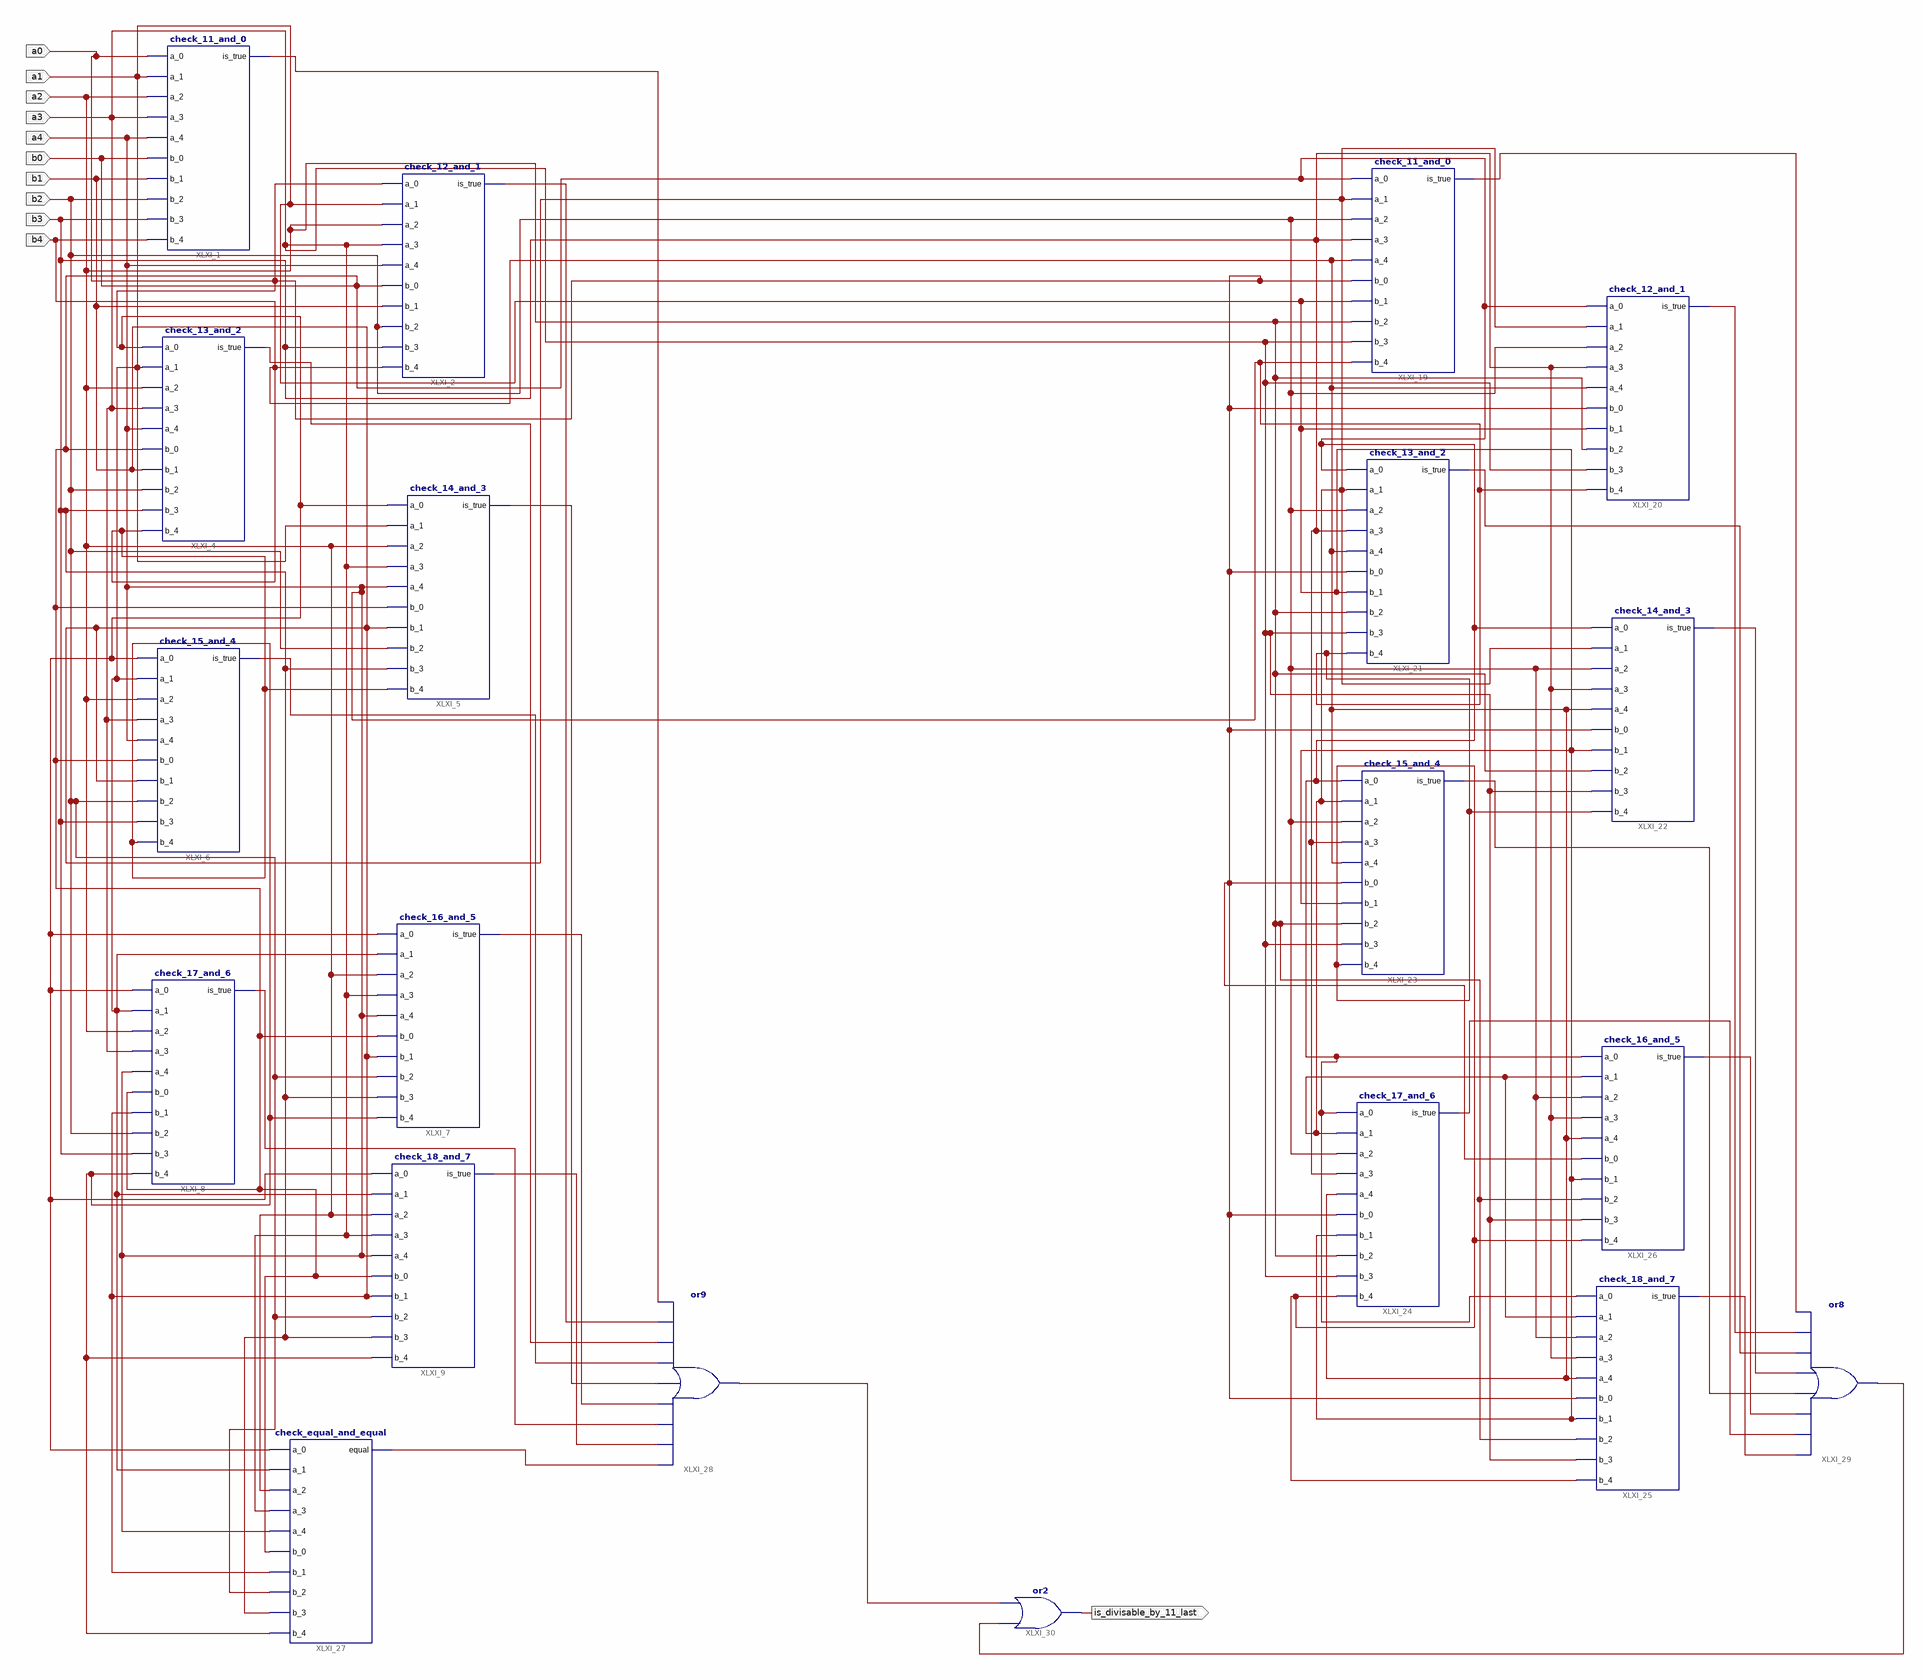
[diagram p0: schematic sheet 1]
// Xilinx ISE schematic divide_by_11_remainder.sch (spartan3adsp) as structural Verilog: 20 symbols, 11 ports
module divide_by_11_remainder (
  input  a1,
  input  a2,
  input  a3,
  input  a4,
  input  b1,
  input  b2,
  input  b3,
  input  b4,
  input  a0,
  input  b0,
  output is_divisable_by_11_last
);

  wire XLXN_142, XLXN_143, XLXN_144, XLXN_145, XLXN_146, XLXN_147, XLXN_148, XLXN_149, XLXN_150, XLXN_151,
       XLXN_152, XLXN_153, XLXN_154, XLXN_155, XLXN_156, XLXN_157, XLXN_158, XLXN_159, XLXN_160;

  check_11_and_0 XLXI_1 (
    .a_0(a0), .a_1(a1), .a_2(a2), .a_3(a3), .a_4(a4), .b_0(b0), .b_1(b1), .b_2(b2), .b_3(b3), .b_4(b4),
    .is_true(XLXN_152));
  check_12_and_1 XLXI_2 (
    .a_0(a0), .a_1(a1), .a_2(a2), .a_3(a3), .a_4(a4), .b_0(b0), .b_1(b1), .b_2(b2), .b_3(b3), .b_4(b4),
    .is_true(XLXN_151));
  check_13_and_2 XLXI_4 (
    .a_0(a0), .a_1(a1), .a_2(a2), .a_3(a3), .a_4(a4), .b_0(b0), .b_1(b1), .b_2(b2), .b_3(b3), .b_4(b4),
    .is_true(XLXN_150));
  check_14_and_3 XLXI_5 (
    .a_0(a0), .a_1(a1), .a_2(a2), .a_3(a3), .a_4(a4), .b_0(b0), .b_1(b1), .b_2(b2), .b_3(b3), .b_4(b4),
    .is_true(XLXN_148));
  check_15_and_4 XLXI_6 (
    .a_0(a0), .a_1(a1), .a_2(a2), .a_3(a3), .a_4(a4), .b_0(b0), .b_1(b1), .b_2(b2), .b_3(b3), .b_4(b4),
    .is_true(XLXN_149));
  check_16_and_5 XLXI_7 (
    .a_0(a0), .a_1(a1), .a_2(a2), .a_3(a3), .a_4(a4), .b_0(b0), .b_1(b1), .b_2(b2), .b_3(b3), .b_4(b4),
    .is_true(XLXN_147));
  check_17_and_6 XLXI_8 (
    .a_0(a0), .a_1(a1), .a_2(a2), .a_3(a3), .a_4(a4), .b_0(b0), .b_1(b1), .b_2(b2), .b_3(b3), .b_4(b4),
    .is_true(XLXN_146));
  check_18_and_7 XLXI_9 (
    .a_0(a0), .a_1(a1), .a_2(a2), .a_3(a3), .a_4(a4), .b_0(b0), .b_1(b1), .b_2(b2), .b_3(b3), .b_4(b4),
    .is_true(XLXN_145));
  check_11_and_0 XLXI_19 (
    .a_0(b0), .a_1(b1), .a_2(b2), .a_3(b3), .a_4(b4), .b_0(a0), .b_1(a1), .b_2(a2), .b_3(a3), .b_4(a4),
    .is_true(XLXN_160));
  check_12_and_1 XLXI_20 (
    .a_0(b0), .a_1(b1), .a_2(b2), .a_3(b3), .a_4(b4), .b_0(a0), .b_1(a1), .b_2(a2), .b_3(a3), .b_4(a4),
    .is_true(XLXN_159));
  check_13_and_2 XLXI_21 (
    .a_0(b0), .a_1(b1), .a_2(b2), .a_3(b3), .a_4(b4), .b_0(a0), .b_1(a1), .b_2(a2), .b_3(a3), .b_4(a4),
    .is_true(XLXN_158));
  check_14_and_3 XLXI_22 (
    .a_0(b0), .a_1(b1), .a_2(b2), .a_3(b3), .a_4(b4), .b_0(a0), .b_1(a1), .b_2(a2), .b_3(a3), .b_4(a4),
    .is_true(XLXN_157));
  check_15_and_4 XLXI_23 (
    .a_0(b0), .a_1(b1), .a_2(b2), .a_3(b3), .a_4(b4), .b_0(a0), .b_1(a1), .b_2(a2), .b_3(a3), .b_4(a4),
    .is_true(XLXN_156));
  check_17_and_6 XLXI_24 (
    .a_0(b0), .a_1(b1), .a_2(b2), .a_3(b3), .a_4(b4), .b_0(a0), .b_1(a1), .b_2(a2), .b_3(a3), .b_4(a4),
    .is_true(XLXN_154));
  check_18_and_7 XLXI_25 (
    .a_0(b0), .a_1(b1), .a_2(b2), .a_3(b3), .a_4(b4), .b_0(a0), .b_1(a1), .b_2(a2), .b_3(a3), .b_4(a4),
    .is_true(XLXN_153));
  check_16_and_5 XLXI_26 (
    .a_0(b0), .a_1(b1), .a_2(b2), .a_3(b3), .a_4(b4), .b_0(a0), .b_1(a1), .b_2(a2), .b_3(a3), .b_4(a4),
    .is_true(XLXN_155));
  check_equal_and_equal XLXI_27 (
    .a_0(a0), .a_1(a1), .a_2(a2), .a_3(a3), .a_4(a4), .b_0(b0), .b_1(b1), .b_2(b2), .b_3(b3), .b_4(b4),
    .equal(XLXN_144));
  or XLXI_28 (XLXN_142, XLXN_144, XLXN_145, XLXN_146, XLXN_147, XLXN_148, XLXN_149, XLXN_150, XLXN_151, XLXN_152);
  or XLXI_29 (XLXN_143, XLXN_153, XLXN_154, XLXN_155, XLXN_156, XLXN_157, XLXN_158, XLXN_159, XLXN_160);
  or XLXI_30 (is_divisable_by_11_last, XLXN_143, XLXN_142);
endmodule
